# EAGLE design EntrenadorEdge_v1 (EAGLE 6.6.0)
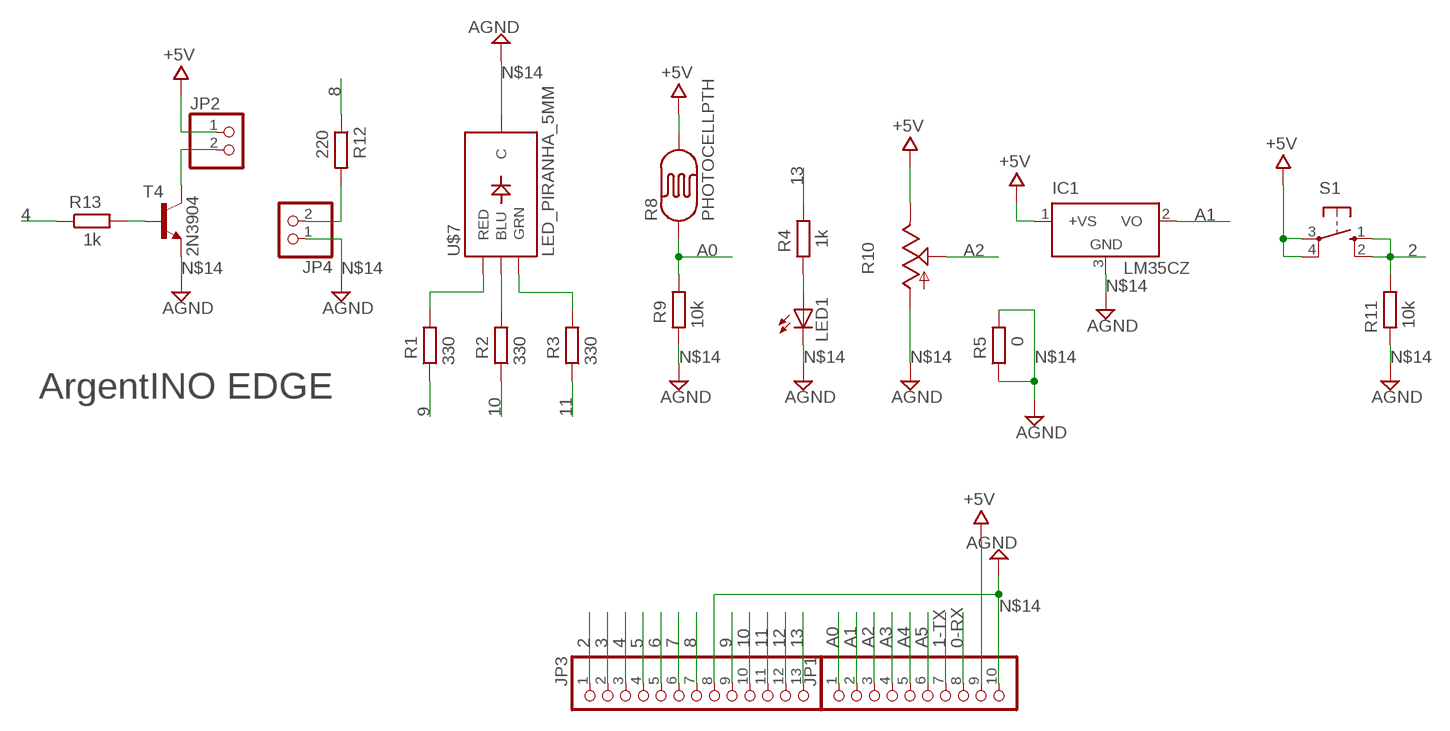
[diagram p0: schematic, sheet 1]

## Parts
IC1  LM35CZ  [TO92]
JP1  PINHD-1X10  [1X10]
JP2  PINHD-1X2  [1X02]
JP3  PINHD-1X13  [1X13]
JP4  PINHD-1X2  [1X02]
LED1  LED3MM  [LED3MM]
R1  330  R-EU_0204/7  [0204/7]
R2  330  R-EU_0204/7  [0204/7]
R3  330  R-EU_0204/7  [0204/7]
R4  1k  R-EU_0204/7  [0204/7]
R5  0  R-EU_0204/7  [0204/7]
R8  PHOTOCELLPTH  [PHOTOCELL]
R9  10k  R-EU_0204/7  [0204/7]
R10  TRIM_US-S63P  [S63P]
R11  10k  R-EU_0204/7  [0204/7]
R12  220  R-EU_0204/7  [0204/7]
R13  1k  R-EU_0204/7  [0204/7]
S1  10-XX  [B3F-10XX]
T4  2N3904  2N3904-NPN-TO92-EBC  [TO92-EBC]
U$7  LED_PIRANHA_5MM  [LED_PIRANHA_5MM]

## Nets
0-RX: JP1.8
1-TX: JP1.7
2: JP3.1 R11.2 S1.1(S) S1.2(S1)
3: JP3.2
4: JP3.3 R13.1
5: JP3.4
6: JP3.5
7: JP3.6
8: JP3.7 R12.1
9: JP3.9 R1.1
10: JP3.10 R2.1
11: JP3.11 R3.1
12: JP3.12
13: JP3.13 R4.2
+5V: IC1.1(+VS) JP1.9 JP2.1 R8.2 R10.E S1.3(P) S1.4(P1)
A0: JP1.1 R8.1 R9.2
A1: IC1.2(VO) JP1.2
A2: JP1.3 R10.S
A3: JP1.4
A4: JP1.5
A5: JP1.6
N$1: R2.2 U$7.B(BLU)
N$2: R3.2 U$7.G(GRN)
N$3: R1.2 U$7.R(RED)
N$10: JP4.2 R12.2
N$11: R13.2 T4.B
N$13: JP2.2 T4.C
N$14: IC1.3(GND) JP1.10 JP3.8 JP4.1 LED1.K(C) R5.1 R5.2 R9.1 R10.A R11.1 T4.E U$7.-(C) ; supply symbol labelled AGND
N$40: LED1.A R4.1

## Notes on the sheet
- ArgentINO EDGE

## Library data of the parts
IC1 = lm35:LM35: Single-Supply Centigrade Temperature Sensor Vout = (10mV/°C x Temp °C) +5mmmV Source: http://www.national.com/ds/LM/LM35.pdf
JP1 = pinhead:PINHD-1X10: PIN HEADER
JP2 JP4 = pinhead:PINHD-1X2: PIN HEADER
JP3 = pinhead:PINHD-1X13: PIN HEADER
LED1 = led:LED: LED OSRAM: - CHIPLED LG R971, LG N971, LY N971, LG Q971, LY Q971, LO R971, LY R971 LH N974, LH R974 LS Q976, LO Q976, LY Q976 LO Q996 - Hyper CHIPLED LW Q18S LB Q993, LB Q99A, LB R99A - SideLED LS A670, LO A670, LY A670, LG A670, LP A670 LB A673, LV A673, LT A673, LW A673 LH A674 LY A675 LS A676, LA A676, LO A676, LY A676, LW A676 LS A679, LY A679, LG A679 - Hyper Micro SIDELED® LS Y876, LA Y876, LO Y876, LY Y876 LT Y87S - SmartLED LW L88C, LW L88S LB L89C, LB L89S, LG L890 LS L89K, LO L89K, LY L89K LS L896, LA L896, LO L896, LY L896 - TOPLED LS T670, LO T670, LY T670, LG T670, LP T670 LSG T670, LSP T670, LSY T670, LOP T670, LYG T670 LG T671, LOG T671, LSG T671 LB T673, LV T673, LT T673, LW T673 LH T674 LS T676, LA T676, LO T676, LY T676, LB T676, LH T676, LSB T676, LW T676 LB T67C, LV T67C, LT T67C, LS T67K, LO T67K, LY T67K, LW E67C LS E67B, LA E67B, LO E67B, LY E67B, LB E67C, LV E67C, LT E67C LW T67C LS T679, LY T679, LG T679 LS T770, LO T770, LY T770, LG T770, LP T770 LB T773, LV T773, LT T773, LW T773 LH T774 LS E675, LA E675, LY E675, LS T675 LS T776, LA T776, LO T776, LY T776, LB T776 LHGB T686 LT T68C, LB T68C - Hyper Mini TOPLED® LB M676 - Mini TOPLED Santana® LG M470 LS M47K, LO M47K, LY M47K Source: http://www.osram.convergy.de LUXEON: - LUMILED® LXK2-PW12-R00, LXK2-PW12-S00, LXK2-PW14-U00, LXK2-PW14-V00 LXK2-PM12-R00, LXK2-PM12-S00, LXK2-PM14-U00 LXK2-PE12-Q00, LXK2-PE12-R00, LXK2-PE12-S00, LXK2-PE14-T00, LXK2-PE14-U00 LXK2-PB12-K00, LXK2-PB12-L00, LXK2-PB12-M00, LXK2-PB14-N00, LXK2-PB14-P00, LXK2-PB14-Q00 LXK2-PR12-L00, LXK2-PR12-M00, LXK2-PR14-Q00, LXK2-PR14-R00 LXK2-PD12-Q00, LXK2-PD12-R00, LXK2-PD12-S00 LXK2-PH12-R00, LXK2-PH12-S00 LXK2-PL12-P00, LXK2-PL12-Q00, LXK2-PL12-R00 Source: www.luxeon.com KINGBRIGHT: KA-3528ASYC Source: www.kingbright.com
R1-R5 R9 R11-R13 = rcl:R-EU_: RESISTOR, European symbol
R8 = SparkFun-Sensors:PHOTOCELL: CdS photoresistor. This is a low cost way to detect light levels. Resistance decreases with more incoming light. SparkFun SKU: SEN-09088
R10 = pot:TRIM_US-: POTENTIOMETER
S1 = switch-omron:10-XX: OMRON SWITCH; MPN: B3F-1000; OC_FARNELL: 176432; OC_NEWARK: 36M3542
T4 = transistor-neu-to92:*-NPN-: NPN Transistror
U$7 = SparkFun-LED:LED_PIRANHA_5MM: High-brightness RGB through-hole LED, similar to that used in the Shiftbrite

## Board
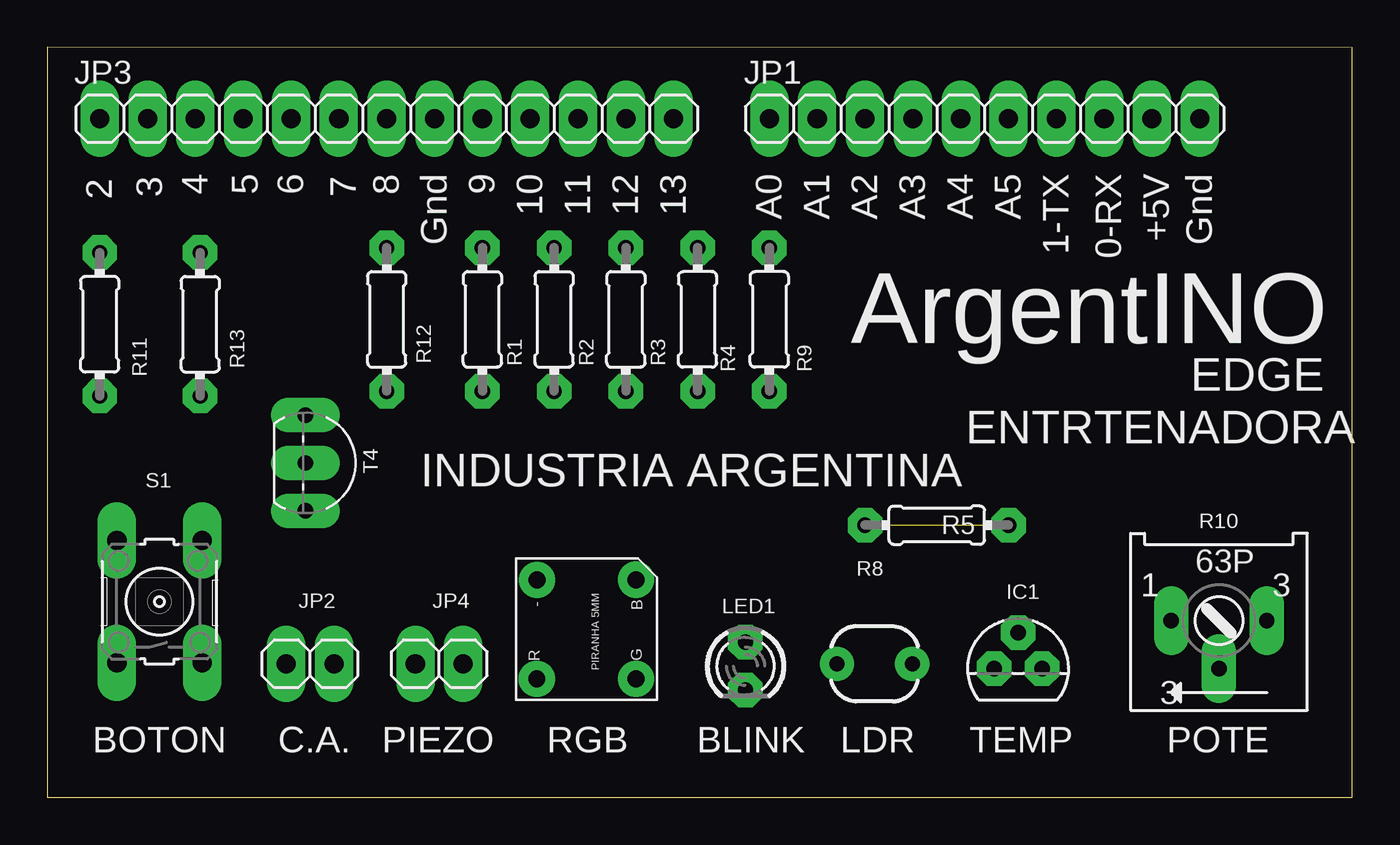
[diagram p1: board, top side]
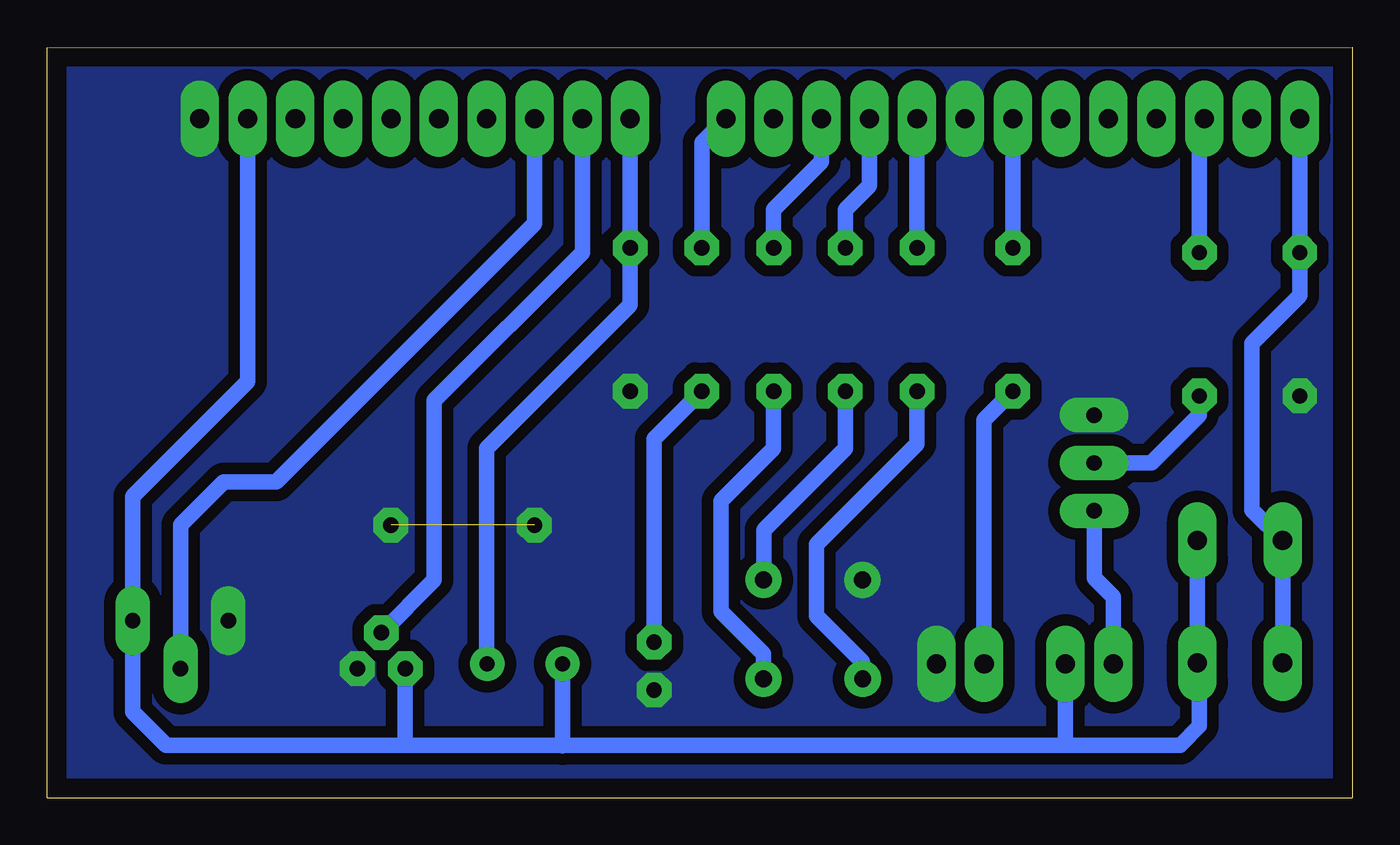
[diagram p2: board, bottom side, seen from below]

Size 69.32 x 39.88 mm. Coordinates in mm from the lower left corner, seen from the top.
Outline: 69.3,39.85 69.3,0 0,0 0,39.88 69.32,39.85
Copper layers (1*16): Top 0.035mm / dielectric 1.5mm / Bottom 0.035mm
Design rules "default *": minimum track width 10mil, minimum drill 24mil, track to track 8mil, track to pad 8mil, pad to pad 8mil, via to via 8mil, smd to smd 8mil, copper to edge 40mil, drill to drill 8mil, minimum pad ring 20mil, minimum via ring 8mil, stop-mask expansion 4mil, vias tented up to drill 0mil, thermal gap 20mil

### Footprints (pad centres in the part's own frame; a part is rotated, then mirrored left to right if it is on the bottom)
TO92 = drill 0.813 octagon: 1 -1.27,0; 2 0,1.905; 3 1.27,0
1X10 = drill 1.016 long: 1 -11.43,0; 2 -8.89,0; 3 -6.35,0; 4 -3.81,0; 5 -1.27,0; 6 1.27,0; 7 3.81,0; 8 6.35,0; 9 8.89,0; 10 11.43,0
1X02 = drill 1.016 long: 1 -1.27,0; 2 1.27,0
1X13 = drill 1.016 long: 1 -15.24,0; 2 -12.7,0; 3 -10.16,0; 4 -7.62,0; 5 -5.08,0; 6 -2.54,0; 7 0,0; 8 2.54,0; 9 5.08,0; 10 7.62,0; 11 10.16,0; 12 12.7,0; 13 15.24,0
LED3MM = drill 0.813 octagon: A -1.27,0; K 1.27,0
0204/7 = drill 0.813 octagon: 1 -3.81,0; 2 3.81,0
PHOTOCELL = drill 0.8 pad 1.676: 1 -2,0; 2 2,0
S63P = drill 0.813 long: A 2.54,0; E -2.54,0; S 0,2.54
B3F-10XX = drill 1.016 long: 1 -3.251,2.261; 2 3.251,2.261; 3 -3.251,-2.261; 4 3.251,-2.261
TO92-EBC = drill 0.813 long: B 0,-1.27; C 2.54,-1.27; E -2.54,-1.27
LED_PIRANHA_5MM = drill 0.9: - -2.684,-2.684; B -2.688,2.574; G 2.575,2.562; R 2.579,-2.696

### Placement (x,y rotation side)
IC1  51.56,6.87 0 top
JP1  49.78,36.08 0 top
JP2  13.97,7.12 180 top
JP3  18.03,36.08 0 top
JP4  20.83,7.12 180 top
LED1  37.08,7 270 top
R1  23.11,25.41 270 top
R2  26.92,25.41 270 top
R3  30.73,25.41 270 top
R4  34.54,25.41 90 top
R5  47.24,14.49 0 top
R8  43.94,7.12 180 top
R9  38.35,25.41 90 top
R10  62.23,9.41 180 top
R11  2.79,25.16 90 top
R12  18.03,25.41 270 top
R13  8.13,25.16 270 top
S1  5.97,10.42 90 top
T4  14.99,17.79 270 top
U$7  28.7,8.9 270 top

### Tracks (layer width: path | path; a pad name or v marks a point on that pad's centre or on a via)
2
  Bottom 0.813: JP3.1 R11.2 2.79,26.68 5.33,24.14 5.33,15.3 S1.2 S1.1
4
  Bottom 0.813: R13.1 8.13,35.82 JP3.3
8
  Bottom 0.813: R12.1 JP3.7
9
  Bottom 0.813: JP3.9 R1.1
10
  Bottom 0.813: JP3.10 25.65,32.52 26.92,31.25 R2.1
11
  Bottom 0.813: JP3.11 28.19,33.79 30.73,31.25 R3.1
13
  Bottom 0.813: R4.2 34.54,34.81 JP3.13
+5V
  Bottom 0.813: S1.4 S1.3 8.13,7.07 8.13,3.82 9.14,2.8 15.24,2.8 | JP1.9 58.67,22.11 64.77,16.01 R10.E 64.77,4.58 62.99,2.8 50.29,2.8 | 50.29,2.8 41.91,2.8 | 41.91,2.8 15.24,2.8 | JP2.1 15.24,2.8 | R8.2 41.94,2.77 41.91,2.8 | IC1.1 50.29,2.8
A0
  Bottom 0.813: JP1.1 R9.2 38.35,26.17 45.97,18.55 45.97,7.15 R8.1
A1
  Bottom 0.813: JP1.2 40.89,28.97 48.77,21.09 48.77,11.57 IC1.2
A2
  Bottom 0.813: JP1.3 43.43,30.49 57.15,16.77 59.94,16.77 62.23,14.49 R10.S
N$1
  Bottom 0.813: R2.2 26.92,18.55 31.24,14.23 31.24,11.62 U$7.B
N$2
  Bottom 0.813: U$7.G 31.26,7.65 33.53,9.92 33.53,15.76 30.73,18.55 R3.2
N$3
  Bottom 0.813: U$7.R 26.01,7.22 28.45,9.66 28.45,13.47 23.11,18.81 R1.2
N$10
  Bottom 0.813: JP4.2 19.56,20.08 R12.2
N$11
  Bottom 0.813: R13.2 8.13,20.33 10.67,17.79 T4.B
N$13
  Bottom 0.813: T4.C 13.72,11.69 12.7,10.68 JP2.2
N$14  (1 unrouted)
  pour Bottom (isolate 0.61, no thermals): 0,39.76 69.21,39.76 69.21,0.01 0,0.01
N$40
  Bottom 0.813: LED1.A 37.08,19.06 R4.1

### Text on the board
tNames: 2 | 3 | 4 | 5 | 6 | 7 | 8 | Gnd | 9 | 10 | 11 | 12 | 13 | A0 | A1 | A2 | A3 | A4 | A5 | 1-TX | 0-RX | +5V | Gnd | ArgentINO | EDGE | ENTRTENADORA | INDUSTRIA ARGENTINA | BOTON | C.A. | PIEZO | RGB | BLINK | LDR | TEMP | POTE